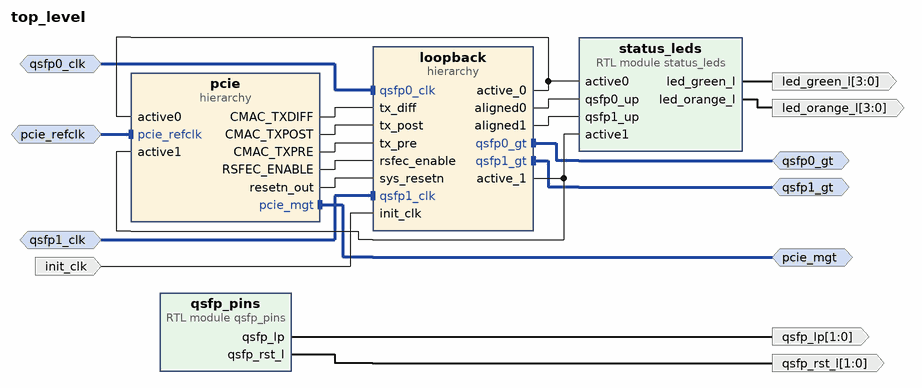
[diagram p0: block diagram of the top level]
# Vivado block design top_level, xcvu3p-ffvc1517-2-e, Vivado 2021.1
create_bd_design top_level

create_bd_intf_port -mode Slave -vlnv xilinx.com:interface:diff_clock_rtl:1.0 qsfp0_clk
set_property -dict {CONFIG.FREQ_HZ 322265625} [get_bd_intf_ports qsfp0_clk]
create_bd_intf_port -mode Master -vlnv xilinx.com:interface:gt_rtl:1.0 qsfp0_gt
create_bd_intf_port -mode Master -vlnv xilinx.com:interface:gt_rtl:1.0 qsfp1_gt
create_bd_intf_port -mode Slave -vlnv xilinx.com:interface:diff_clock_rtl:1.0 qsfp1_clk
set_property -dict {CONFIG.FREQ_HZ 322265625} [get_bd_intf_ports qsfp1_clk]
create_bd_intf_port -mode Slave -vlnv xilinx.com:interface:diff_clock_rtl:1.0 pcie_refclk
create_bd_intf_port -mode Master -vlnv xilinx.com:interface:pcie_7x_mgt_rtl:1.0 pcie_mgt
create_bd_port -dir O -from 3 -to 0 led_green_l
create_bd_port -dir O -from 3 -to 0 led_orange_l
create_bd_port -dir O -from 1 -to 0 qsfp_rst_l
create_bd_port -dir O -from 1 -to 0 qsfp_lp
create_bd_port -dir I init_clk

create_bd_cell -type hier loopback
create_bd_cell -type hier pcie
create_bd_cell -type module -reference status_leds status_leds
create_bd_cell -type module -reference qsfp_pins qsfp_pins

# ---- hierarchy /loopback ----
current_bd_instance /loopback
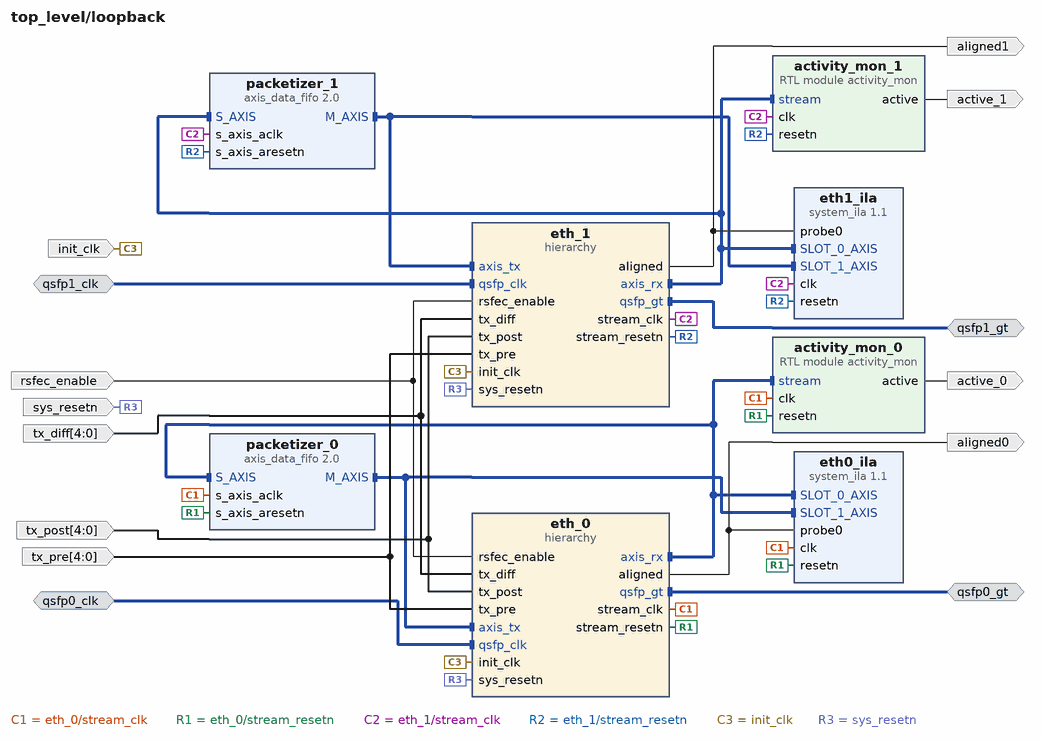
[diagram p1: block diagram inside /loopback]
create_bd_intf_pin -mode Master -vlnv xilinx.com:interface:gt_rtl:1.0 qsfp0_gt
create_bd_intf_pin -mode Slave -vlnv xilinx.com:interface:diff_clock_rtl:1.0 qsfp0_clk
create_bd_intf_pin -mode Master -vlnv xilinx.com:interface:gt_rtl:1.0 qsfp1_gt
create_bd_intf_pin -mode Slave -vlnv xilinx.com:interface:diff_clock_rtl:1.0 qsfp1_clk
create_bd_pin -dir I init_clk
create_bd_pin -dir I rsfec_enable
create_bd_pin -dir I -from 4 -to 0 tx_pre
create_bd_pin -dir I sys_resetn
create_bd_pin -dir O active_0
create_bd_pin -dir O active_1
create_bd_pin -dir O aligned0
create_bd_pin -dir O aligned1
create_bd_pin -dir I -from 4 -to 0 tx_post
create_bd_pin -dir I -from 4 -to 0 tx_diff

create_bd_cell -type ip -vlnv xilinx.com:ip:system_ila:1.1 eth1_ila
set_property -dict [list \
  CONFIG.C_MON_TYPE MIX \
  CONFIG.C_NUM_MONITOR_SLOTS 2 \
  CONFIG.C_SLOT 0 \
  CONFIG.C_SLOT_0_INTF_TYPE xilinx.com:interface:axis_rtl:1.0 \
  CONFIG.C_SLOT_1_INTF_TYPE xilinx.com:interface:axis_rtl:1.0 \
] [get_bd_cells eth1_ila]
create_bd_cell -type ip -vlnv xilinx.com:ip:axis_data_fifo:2.0 packetizer_1
set_property -dict {CONFIG.FIFO_DEPTH 4096 CONFIG.FIFO_MODE 2} [get_bd_cells packetizer_1]
create_bd_cell -type ip -vlnv xilinx.com:ip:axis_data_fifo:2.0 packetizer_0
set_property -dict {CONFIG.FIFO_DEPTH 4096 CONFIG.FIFO_MODE 2} [get_bd_cells packetizer_0]
create_bd_cell -type ip -vlnv xilinx.com:ip:system_ila:1.1 eth0_ila
set_property -dict [list \
  CONFIG.C_MON_TYPE MIX \
  CONFIG.C_NUM_MONITOR_SLOTS 2 \
  CONFIG.C_SLOT 0 \
  CONFIG.C_SLOT_0_INTF_TYPE xilinx.com:interface:axis_rtl:1.0 \
  CONFIG.C_SLOT_1_INTF_TYPE xilinx.com:interface:axis_rtl:1.0 \
] [get_bd_cells eth0_ila]
create_bd_cell -type hier eth_0
create_bd_cell -type hier eth_1
create_bd_cell -type module -reference activity_mon activity_mon_0
create_bd_cell -type module -reference activity_mon activity_mon_1

# ---- hierarchy /loopback/eth_0 ----
current_bd_instance /loopback/eth_0
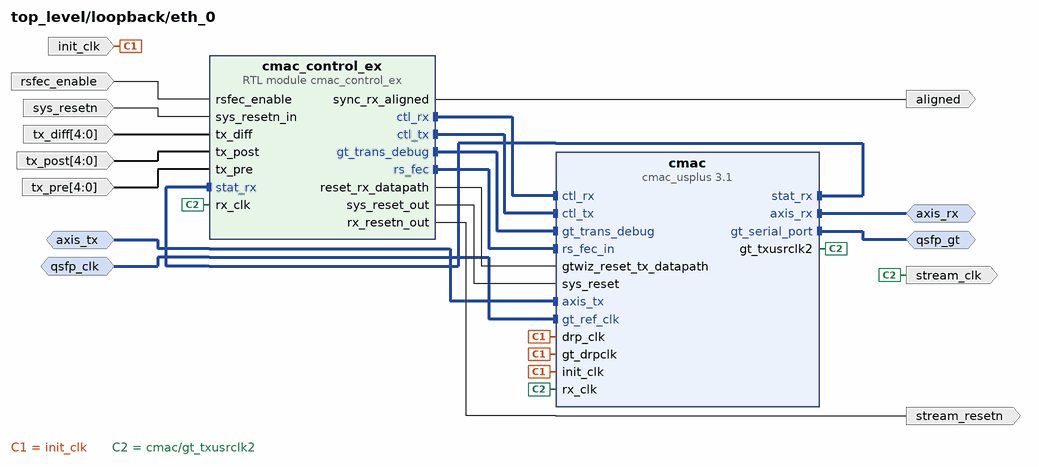
[diagram p2: block diagram inside /loopback/eth_0]
create_bd_intf_pin -mode Master -vlnv xilinx.com:interface:gt_rtl:1.0 qsfp_gt
create_bd_intf_pin -mode Slave -vlnv xilinx.com:interface:diff_clock_rtl:1.0 qsfp_clk
create_bd_intf_pin -mode Slave -vlnv xilinx.com:interface:axis_rtl:1.0 axis_tx
create_bd_intf_pin -mode Master -vlnv xilinx.com:interface:axis_rtl:1.0 axis_rx
create_bd_pin -dir I -type rst sys_resetn
create_bd_pin -dir O -type clk stream_clk
create_bd_pin -dir O -type rst stream_resetn
create_bd_pin -dir O aligned
create_bd_pin -dir I init_clk
create_bd_pin -dir I rsfec_enable
create_bd_pin -dir I -from 4 -to 0 tx_pre
create_bd_pin -dir I -from 4 -to 0 tx_post
create_bd_pin -dir I -from 4 -to 0 tx_diff

create_bd_cell -type ip -vlnv xilinx.com:ip:cmac_usplus:3.1 cmac
set_property -dict [list \
  CONFIG.ADD_GT_CNRL_STS_PORTS 1 \
  CONFIG.CMAC_CAUI4_MODE 1 \
  CONFIG.CMAC_CORE_SELECT CMACE4_X0Y2 \
  CONFIG.GT_DRP_CLK 100 \
  CONFIG.GT_GROUP_SELECT {X0Y16~X0Y19} \
  CONFIG.GT_REF_CLK_FREQ 322.265625 \
  CONFIG.INCLUDE_RS_FEC 1 \
  CONFIG.NUM_LANES 4x25 \
  CONFIG.RX_FLOW_CONTROL 0 \
  CONFIG.TX_FLOW_CONTROL 0 \
  CONFIG.USER_INTERFACE AXIS \
] [get_bd_cells cmac]
create_bd_cell -type module -reference cmac_control_ex cmac_control_ex

# ---- hierarchy /loopback/eth_1 ----
current_bd_instance /loopback/eth_1
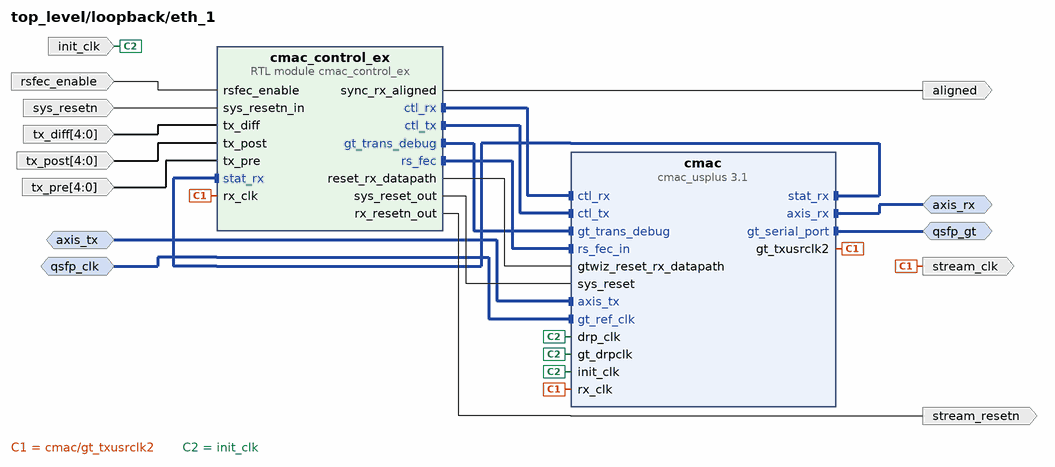
[diagram p3: block diagram inside /loopback/eth_1]
create_bd_intf_pin -mode Master -vlnv xilinx.com:interface:gt_rtl:1.0 qsfp_gt
create_bd_intf_pin -mode Slave -vlnv xilinx.com:interface:axis_rtl:1.0 axis_tx
create_bd_intf_pin -mode Master -vlnv xilinx.com:interface:axis_rtl:1.0 axis_rx
create_bd_intf_pin -mode Slave -vlnv xilinx.com:interface:diff_clock_rtl:1.0 qsfp_clk
create_bd_pin -dir I -type rst sys_resetn
create_bd_pin -dir O -type clk stream_clk
create_bd_pin -dir O -type rst stream_resetn
create_bd_pin -dir O aligned
create_bd_pin -dir I init_clk
create_bd_pin -dir I rsfec_enable
create_bd_pin -dir I -from 4 -to 0 tx_pre
create_bd_pin -dir I -from 4 -to 0 tx_post
create_bd_pin -dir I -from 4 -to 0 tx_diff

create_bd_cell -type ip -vlnv xilinx.com:ip:cmac_usplus:3.1 cmac
set_property -dict [list \
  CONFIG.ADD_GT_CNRL_STS_PORTS 1 \
  CONFIG.CMAC_CAUI4_MODE 1 \
  CONFIG.CMAC_CORE_SELECT CMACE4_X0Y0 \
  CONFIG.GT_DRP_CLK 100 \
  CONFIG.GT_GROUP_SELECT {X0Y4~X0Y7} \
  CONFIG.GT_REF_CLK_FREQ 322.265625 \
  CONFIG.INCLUDE_RS_FEC 1 \
  CONFIG.NUM_LANES 4x25 \
  CONFIG.RX_FLOW_CONTROL 0 \
  CONFIG.TX_FLOW_CONTROL 0 \
  CONFIG.USER_INTERFACE AXIS \
] [get_bd_cells cmac]
create_bd_cell -type module -reference cmac_control_ex cmac_control_ex

# ---- hierarchy /pcie ----
current_bd_instance /pcie
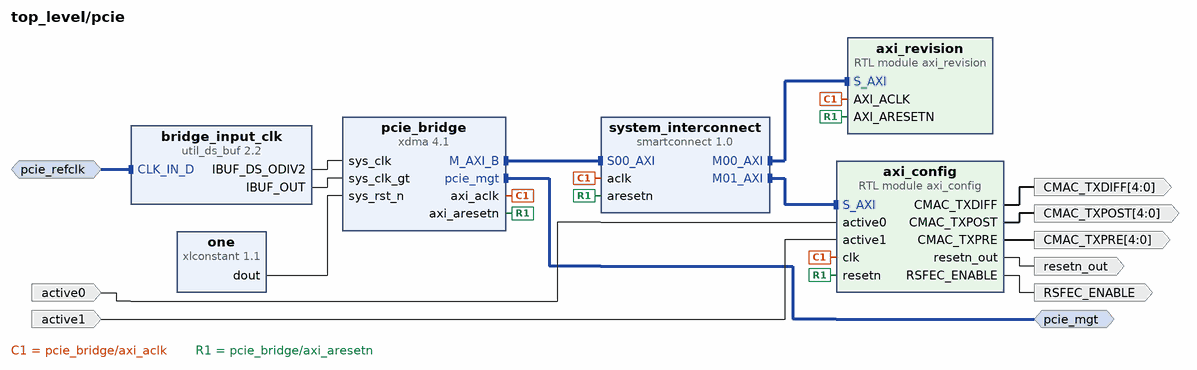
[diagram p4: block diagram inside /pcie]
create_bd_intf_pin -mode Master -vlnv xilinx.com:interface:pcie_7x_mgt_rtl:1.0 pcie_mgt
create_bd_intf_pin -mode Slave -vlnv xilinx.com:interface:diff_clock_rtl:1.0 pcie_refclk
create_bd_pin -dir O RSFEC_ENABLE
create_bd_pin -dir O -from 4 -to 0 CMAC_TXPRE
create_bd_pin -dir O resetn_out
create_bd_pin -dir I active0
create_bd_pin -dir I active1
create_bd_pin -dir O -from 4 -to 0 CMAC_TXPOST
create_bd_pin -dir O -from 4 -to 0 CMAC_TXDIFF

create_bd_cell -type ip -vlnv xilinx.com:ip:xlconstant:1.1 one
create_bd_cell -type ip -vlnv xilinx.com:ip:xdma:4.1 pcie_bridge
set_property -dict [list \
  CONFIG.PF0_DEVICE_ID_mqdma 903F \
  CONFIG.PF0_SRIOV_VF_DEVICE_ID A03F \
  CONFIG.PF2_DEVICE_ID_mqdma 923F \
  CONFIG.PF3_DEVICE_ID_mqdma 933F \
  CONFIG.axi_addr_width 64 \
  CONFIG.axi_data_width 512_bit \
  CONFIG.axisten_freq 250 \
  CONFIG.bridge_burst true \
  CONFIG.en_axi_master_if true \
  CONFIG.en_axi_slave_if false \
  CONFIG.functional_mode AXI_Bridge \
  CONFIG.mode_selection Advanced \
  CONFIG.pf0_bar0_scale Megabytes \
  CONFIG.pf0_bar0_size 1 \
  CONFIG.pf0_bar1_enabled true \
  CONFIG.pf0_bar1_scale Megabytes \
  CONFIG.pf0_bar1_size 1 \
  CONFIG.pf0_device_id 903F \
  CONFIG.pl_link_cap_max_link_speed 8.0_GT/s \
  CONFIG.pl_link_cap_max_link_width X16 \
  CONFIG.plltype QPLL1 \
] [get_bd_cells pcie_bridge]
create_bd_cell -type ip -vlnv xilinx.com:ip:util_ds_buf:2.2 bridge_input_clk
set_property -dict {CONFIG.C_BUF_TYPE IBUFDSGTE} [get_bd_cells bridge_input_clk]
create_bd_cell -type ip -vlnv xilinx.com:ip:smartconnect:1.0 system_interconnect
set_property -dict {CONFIG.NUM_MI 2 CONFIG.NUM_SI 1} [get_bd_cells system_interconnect]
create_bd_cell -type module -reference axi_config axi_config
create_bd_cell -type module -reference axi_revision axi_revision

# ---- connections ----

current_bd_instance /loopback
connect_bd_intf_net [get_bd_intf_pins packetizer_0/S_AXIS] [get_bd_intf_pins eth_0/axis_rx]
connect_bd_intf_net [get_bd_intf_pins packetizer_0/S_AXIS] [get_bd_intf_pins eth0_ila/SLOT_0_AXIS]
connect_bd_intf_net [get_bd_intf_pins packetizer_0/S_AXIS] [get_bd_intf_pins activity_mon_0/stream]
connect_bd_intf_net [get_bd_intf_pins packetizer_0/M_AXIS] [get_bd_intf_pins eth_0/axis_tx]
connect_bd_intf_net [get_bd_intf_pins packetizer_0/M_AXIS] [get_bd_intf_pins eth0_ila/SLOT_1_AXIS]
connect_bd_intf_net [get_bd_intf_pins eth_1/axis_rx] [get_bd_intf_pins packetizer_1/S_AXIS]
connect_bd_intf_net [get_bd_intf_pins eth_1/axis_rx] [get_bd_intf_pins eth1_ila/SLOT_0_AXIS]
connect_bd_intf_net [get_bd_intf_pins eth_1/axis_rx] [get_bd_intf_pins activity_mon_1/stream]
connect_bd_intf_net [get_bd_intf_pins packetizer_1/M_AXIS] [get_bd_intf_pins eth_1/axis_tx]
connect_bd_intf_net [get_bd_intf_pins packetizer_1/M_AXIS] [get_bd_intf_pins eth1_ila/SLOT_1_AXIS]
connect_bd_intf_net [get_bd_intf_pins qsfp0_gt] [get_bd_intf_pins eth_0/qsfp_gt]
connect_bd_intf_net [get_bd_intf_pins qsfp1_gt] [get_bd_intf_pins eth_1/qsfp_gt]
connect_bd_intf_net [get_bd_intf_pins qsfp0_clk] [get_bd_intf_pins eth_0/qsfp_clk]
connect_bd_intf_net [get_bd_intf_pins qsfp1_clk] [get_bd_intf_pins eth_1/qsfp_clk]
connect_bd_net [get_bd_pins activity_mon_0/active] [get_bd_pins active_0]
connect_bd_net -net activity_mon_0_active1 [get_bd_pins activity_mon_1/active] [get_bd_pins active_1]
connect_bd_net -net eth0_aligned [get_bd_pins eth_0/aligned] [get_bd_pins eth0_ila/probe0] [get_bd_pins aligned0]
connect_bd_net -net eth1_aligned [get_bd_pins eth_1/aligned] [get_bd_pins eth1_ila/probe0] [get_bd_pins aligned1]
connect_bd_net [get_bd_pins eth_0/stream_clk] [get_bd_pins packetizer_0/s_axis_aclk] [get_bd_pins eth0_ila/clk] [get_bd_pins activity_mon_0/clk]
connect_bd_net [get_bd_pins eth_0/stream_resetn] \
  [get_bd_pins packetizer_0/s_axis_aresetn] [get_bd_pins eth0_ila/resetn] [get_bd_pins activity_mon_0/resetn]
connect_bd_net [get_bd_pins eth_1/stream_clk] [get_bd_pins packetizer_1/s_axis_aclk] [get_bd_pins eth1_ila/clk] [get_bd_pins activity_mon_1/clk]
connect_bd_net [get_bd_pins eth_1/stream_resetn] \
  [get_bd_pins packetizer_1/s_axis_aresetn] [get_bd_pins eth1_ila/resetn] [get_bd_pins activity_mon_1/resetn]
connect_bd_net -net init_clk_0_1 [get_bd_pins init_clk] [get_bd_pins eth_1/init_clk] [get_bd_pins eth_0/init_clk]
connect_bd_net [get_bd_pins rsfec_enable] [get_bd_pins eth_0/rsfec_enable] [get_bd_pins eth_1/rsfec_enable]
connect_bd_net -net source_200Mhz_resetn [get_bd_pins sys_resetn] [get_bd_pins eth_0/sys_resetn] [get_bd_pins eth_1/sys_resetn]
connect_bd_net [get_bd_pins tx_diff] [get_bd_pins eth_0/tx_diff] [get_bd_pins eth_1/tx_diff]
connect_bd_net [get_bd_pins tx_post] [get_bd_pins eth_0/tx_post] [get_bd_pins eth_1/tx_post]
connect_bd_net [get_bd_pins tx_pre] [get_bd_pins eth_0/tx_pre] [get_bd_pins eth_1/tx_pre]

current_bd_instance /loopback/eth_0
connect_bd_intf_net [get_bd_intf_pins axis_tx] [get_bd_intf_pins cmac/axis_tx]
connect_bd_intf_net [get_bd_intf_pins axis_rx] [get_bd_intf_pins cmac/axis_rx]
connect_bd_intf_net [get_bd_intf_pins cmac_control_ex/ctl_rx] [get_bd_intf_pins cmac/ctl_rx]
connect_bd_intf_net [get_bd_intf_pins cmac_control_ex/ctl_tx] [get_bd_intf_pins cmac/ctl_tx]
connect_bd_intf_net [get_bd_intf_pins cmac_control_ex/gt_trans_debug] [get_bd_intf_pins cmac/gt_trans_debug]
connect_bd_intf_net [get_bd_intf_pins cmac_control_ex/rs_fec] [get_bd_intf_pins cmac/rs_fec_in]
connect_bd_intf_net [get_bd_intf_pins cmac_control_ex/stat_rx] [get_bd_intf_pins cmac/stat_rx]
connect_bd_intf_net [get_bd_intf_pins qsfp_gt] [get_bd_intf_pins cmac/gt_serial_port]
connect_bd_intf_net [get_bd_intf_pins qsfp_clk] [get_bd_intf_pins cmac/gt_ref_clk]
connect_bd_net -net clk_0_1 [get_bd_pins init_clk] [get_bd_pins cmac/init_clk] [get_bd_pins cmac/drp_clk] [get_bd_pins cmac/gt_drpclk]
connect_bd_net [get_bd_pins cmac_control_ex/reset_rx_datapath] [get_bd_pins cmac/gtwiz_reset_tx_datapath]
connect_bd_net [get_bd_pins cmac_control_ex/rx_resetn_out] [get_bd_pins stream_resetn]
connect_bd_net [get_bd_pins cmac_control_ex/sync_rx_aligned] [get_bd_pins aligned]
connect_bd_net [get_bd_pins cmac_control_ex/sys_reset_out] [get_bd_pins cmac/sys_reset]
connect_bd_net -net cmac_gt_rxusrclk2 [get_bd_pins cmac/gt_txusrclk2] \
  [get_bd_pins stream_clk] [get_bd_pins cmac/rx_clk] [get_bd_pins cmac_control_ex/rx_clk]
connect_bd_net [get_bd_pins rsfec_enable] [get_bd_pins cmac_control_ex/rsfec_enable]
connect_bd_net [get_bd_pins sys_resetn] [get_bd_pins cmac_control_ex/sys_resetn_in]
connect_bd_net [get_bd_pins tx_diff] [get_bd_pins cmac_control_ex/tx_diff]
connect_bd_net [get_bd_pins tx_post] [get_bd_pins cmac_control_ex/tx_post]
connect_bd_net [get_bd_pins tx_pre] [get_bd_pins cmac_control_ex/tx_pre]

current_bd_instance /loopback/eth_1
connect_bd_intf_net [get_bd_intf_pins axis_tx] [get_bd_intf_pins cmac/axis_tx]
connect_bd_intf_net [get_bd_intf_pins qsfp_clk] [get_bd_intf_pins cmac/gt_ref_clk]
connect_bd_intf_net [get_bd_intf_pins axis_rx] [get_bd_intf_pins cmac/axis_rx]
connect_bd_intf_net [get_bd_intf_pins cmac_control_ex/ctl_rx] [get_bd_intf_pins cmac/ctl_rx]
connect_bd_intf_net [get_bd_intf_pins cmac_control_ex/ctl_tx] [get_bd_intf_pins cmac/ctl_tx]
connect_bd_intf_net [get_bd_intf_pins cmac_control_ex/gt_trans_debug] [get_bd_intf_pins cmac/gt_trans_debug]
connect_bd_intf_net [get_bd_intf_pins cmac_control_ex/rs_fec] [get_bd_intf_pins cmac/rs_fec_in]
connect_bd_intf_net [get_bd_intf_pins cmac_control_ex/stat_rx] [get_bd_intf_pins cmac/stat_rx]
connect_bd_intf_net [get_bd_intf_pins qsfp_gt] [get_bd_intf_pins cmac/gt_serial_port]
connect_bd_net [get_bd_pins cmac_control_ex/reset_rx_datapath] [get_bd_pins cmac/gtwiz_reset_rx_datapath]
connect_bd_net [get_bd_pins cmac_control_ex/rx_resetn_out] [get_bd_pins stream_resetn]
connect_bd_net [get_bd_pins cmac_control_ex/sync_rx_aligned] [get_bd_pins aligned]
connect_bd_net [get_bd_pins cmac_control_ex/sys_reset_out] [get_bd_pins cmac/sys_reset]
connect_bd_net -net cmac_gt_rxusrclk2 [get_bd_pins cmac/gt_txusrclk2] \
  [get_bd_pins stream_clk] [get_bd_pins cmac/rx_clk] [get_bd_pins cmac_control_ex/rx_clk]
connect_bd_net -net init_clk_divider_init_clk [get_bd_pins init_clk] \
  [get_bd_pins cmac/init_clk] [get_bd_pins cmac/drp_clk] [get_bd_pins cmac/gt_drpclk]
connect_bd_net [get_bd_pins rsfec_enable] [get_bd_pins cmac_control_ex/rsfec_enable]
connect_bd_net [get_bd_pins sys_resetn] [get_bd_pins cmac_control_ex/sys_resetn_in]
connect_bd_net [get_bd_pins tx_diff] [get_bd_pins cmac_control_ex/tx_diff]
connect_bd_net [get_bd_pins tx_post] [get_bd_pins cmac_control_ex/tx_post]
connect_bd_net [get_bd_pins tx_pre] [get_bd_pins cmac_control_ex/tx_pre]

current_bd_instance /pcie
connect_bd_intf_net [get_bd_intf_pins pcie_refclk] [get_bd_intf_pins bridge_input_clk/CLK_IN_D]
connect_bd_intf_net [get_bd_intf_pins pcie_bridge/M_AXI_B] [get_bd_intf_pins system_interconnect/S00_AXI]
connect_bd_intf_net [get_bd_intf_pins pcie_mgt] [get_bd_intf_pins pcie_bridge/pcie_mgt]
connect_bd_intf_net [get_bd_intf_pins axi_revision/S_AXI] [get_bd_intf_pins system_interconnect/M00_AXI]
connect_bd_intf_net [get_bd_intf_pins system_interconnect/M01_AXI] [get_bd_intf_pins axi_config/S_AXI]
connect_bd_net -net active0_1 [get_bd_pins active0] [get_bd_pins axi_config/active0]
connect_bd_net -net active1_1 [get_bd_pins active1] [get_bd_pins axi_config/active1]
connect_bd_net [get_bd_pins axi_config/CMAC_TXDIFF] [get_bd_pins CMAC_TXDIFF]
connect_bd_net [get_bd_pins axi_config/CMAC_TXPOST] [get_bd_pins CMAC_TXPOST]
connect_bd_net [get_bd_pins axi_config/CMAC_TXPRE] [get_bd_pins CMAC_TXPRE]
connect_bd_net [get_bd_pins axi_config/RSFEC_ENABLE] [get_bd_pins RSFEC_ENABLE]
connect_bd_net [get_bd_pins axi_config/resetn_out] [get_bd_pins resetn_out]
connect_bd_net [get_bd_pins one/dout] [get_bd_pins pcie_bridge/sys_rst_n]
connect_bd_net [get_bd_pins pcie_bridge/axi_aclk] \
  [get_bd_pins system_interconnect/aclk] [get_bd_pins axi_config/clk] [get_bd_pins axi_revision/AXI_ACLK]
connect_bd_net [get_bd_pins pcie_bridge/axi_aresetn] \
  [get_bd_pins system_interconnect/aresetn] [get_bd_pins axi_config/resetn] [get_bd_pins axi_revision/AXI_ARESETN]
connect_bd_net -net util_ds_buf_0_IBUF_DS_ODIV2 [get_bd_pins bridge_input_clk/IBUF_DS_ODIV2] [get_bd_pins pcie_bridge/sys_clk]
connect_bd_net -net util_ds_buf_0_IBUF_OUT [get_bd_pins bridge_input_clk/IBUF_OUT] [get_bd_pins pcie_bridge/sys_clk_gt]

current_bd_instance /
connect_bd_intf_net [get_bd_intf_ports pcie_refclk] [get_bd_intf_pins pcie/pcie_refclk]
connect_bd_intf_net [get_bd_intf_ports qsfp0_gt] [get_bd_intf_pins loopback/qsfp0_gt]
connect_bd_intf_net [get_bd_intf_ports qsfp1_gt] [get_bd_intf_pins loopback/qsfp1_gt]
connect_bd_intf_net [get_bd_intf_ports qsfp0_clk] [get_bd_intf_pins loopback/qsfp0_clk]
connect_bd_intf_net [get_bd_intf_ports qsfp1_clk] [get_bd_intf_pins loopback/qsfp1_clk]
connect_bd_intf_net [get_bd_intf_ports pcie_mgt] [get_bd_intf_pins pcie/pcie_mgt]
connect_bd_net -net init_clk_0_1 [get_bd_ports init_clk] [get_bd_pins loopback/init_clk]
connect_bd_net [get_bd_pins loopback/active_0] [get_bd_pins pcie/active0] [get_bd_pins status_leds/active0]
connect_bd_net [get_bd_pins loopback/active_1] [get_bd_pins pcie/active1] [get_bd_pins status_leds/active1]
connect_bd_net [get_bd_pins loopback/aligned0] [get_bd_pins status_leds/qsfp0_up]
connect_bd_net [get_bd_pins loopback/aligned1] [get_bd_pins status_leds/qsfp1_up]
connect_bd_net [get_bd_pins pcie/CMAC_TXDIFF] [get_bd_pins loopback/tx_diff]
connect_bd_net [get_bd_pins pcie/CMAC_TXPOST] [get_bd_pins loopback/tx_post]
connect_bd_net [get_bd_pins pcie/CMAC_TXPRE] [get_bd_pins loopback/tx_pre]
connect_bd_net [get_bd_pins pcie/RSFEC_ENABLE] [get_bd_pins loopback/rsfec_enable]
connect_bd_net [get_bd_pins pcie/resetn_out] [get_bd_pins loopback/sys_resetn]
connect_bd_net [get_bd_pins qsfp_pins/qsfp_lp] [get_bd_ports qsfp_lp]
connect_bd_net [get_bd_pins qsfp_pins/qsfp_rst_l] [get_bd_ports qsfp_rst_l]
connect_bd_net [get_bd_pins status_leds/led_green_l] [get_bd_ports led_green_l]
connect_bd_net [get_bd_pins status_leds/led_orange_l] [get_bd_ports led_orange_l]

# ---- address map ----
assign_bd_address -offset 0x0000000000000000 -range 128 -target_address_space [get_bd_addr_spaces pcie/pcie_bridge/M_AXI_B] [get_bd_addr_segs pcie/axi_revision/S_AXI/reg0]
assign_bd_address -offset 0x0000000000001000 -range 128 -target_address_space [get_bd_addr_spaces pcie/pcie_bridge/M_AXI_B] [get_bd_addr_segs pcie/axi_config/S_AXI/reg0]

validate_bd_design
save_bd_design
